# EAGLE design Si7020-BreakBoard (EAGLE 7.1.0)
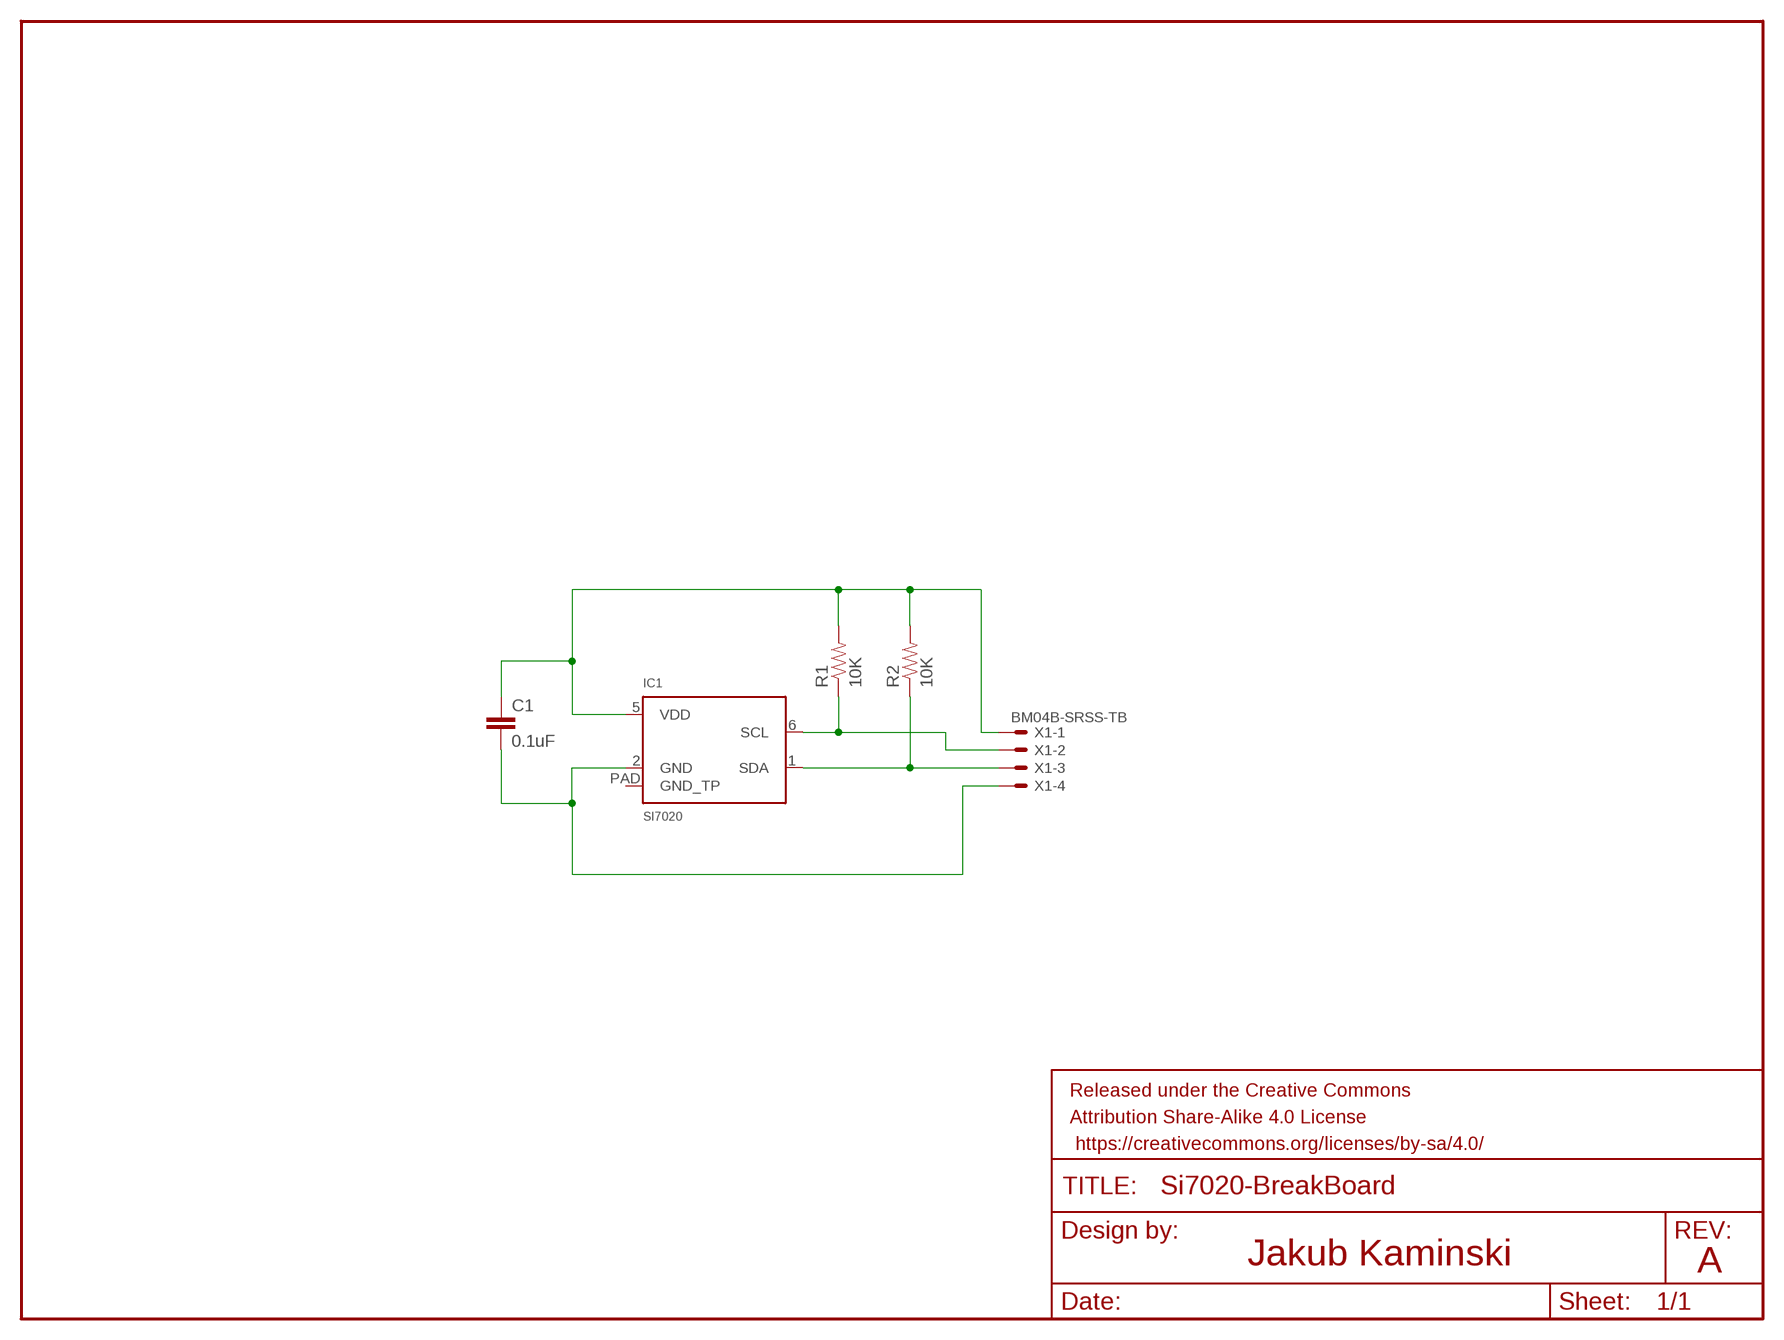
[diagram p0: schematic, sheet 1]

## Parts
C1  0.1uF  0.1UF-25V(+80/-20%)(0603)  [0603-CAP]
FRAME1  FRAME-LETTER  [CREATIVE_COMMONS]
IC1  SI7020  [DFN6-3X3]
R1  10K  10KOHM1/10W1%(0603)0603  [0603-RES]
R2  10K  10KOHM1/10W1%(0603)0603  [0603-RES]
X1  BM04B-SRSS-TB  [BM04B-SRSS-TB]

## Nets
N$1: C1.1 IC1.5(VDD) R1.2 R2.2 X1.1
N$2: IC1.6(SCL) R1.1 X1.2
N$3: C1.2 IC1.2(GND) X1.4
N$4: IC1.1(SDA) R2.1 X1.3
Unconnected: IC1.PAD(GND_TP)

## Notes on the sheet
- Jakub Kaminski | A

## Library data of the parts
C1 = SparkFun-Capacitors:0.1UF-25V(+80/-20%)(0603): CAP-00810 Ceramic Standard decoupling cap; PROD_ID: CAP-00810
FRAME1 = SparkFun-Aesthetics:FRAME-LETTER: Schematic Frame Standard 8.5x11 US Letter frame
IC1 = logic-supply:SI7020: Silicon Labs Si7020 I2C RH sensor
R1 R2 = SparkFun-Resistors:10KOHM1/10W1%(0603): RES-00824; PROD_ID: RES-00824
X1 = con-jst2:?M04B-SRSS-TB: Disconnectable Crimp style connector, 1.0mm pitch 4 contacts

## Board
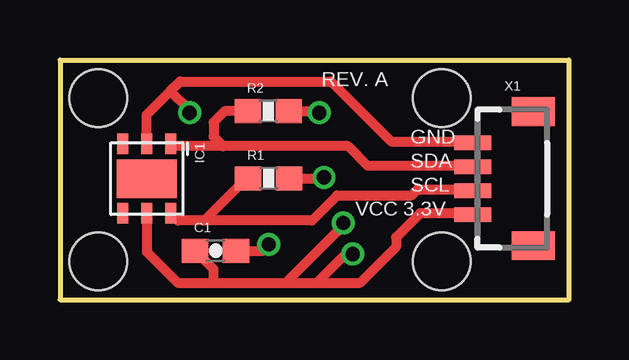
[diagram p1: board, top side]
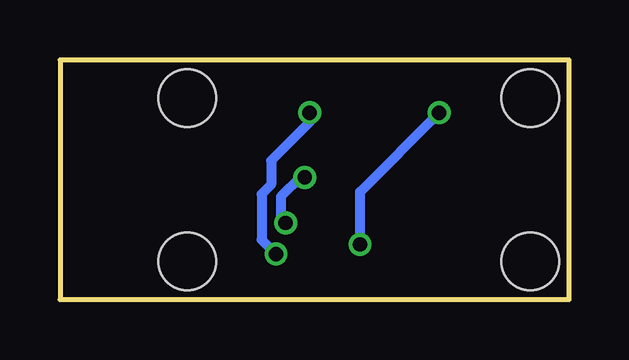
[diagram p2: board, bottom side, seen from below]

Size 21.2 x 10 mm. Coordinates in mm from the lower left corner, seen from the top.
Outline: 0,10 0,0 21.2,0 21.2,10 0,10
Copper layers (1*16): Top 0.0356mm / dielectric 1.5011mm / Bottom 0.0356mm
Design rules "OSHPARK-LaenPCBOrder": minimum track width 6mil, minimum drill 13mil, track to track 6mil, track to pad 6mil, pad to pad 6mil, via to via 6mil, smd to smd 6mil, copper to edge 15mil, drill to drill 6mil, minimum pad ring 7mil, minimum via ring 7mil, stop-mask expansion 3mil, vias tented up to drill 0mil, thermal gap 10mil
Holes 2.4 mm at 1.6,8.4 15.9,8.4 15.9,1.6 1.6,1.6

### Footprints (pad centres in the part's own frame; a part is rotated, then mirrored left to right if it is on the bottom)
0603-CAP = smd 1.1 x 1: 1 -0.85,0; 2 0.85,0
DFN6-3X3 = smd 0.85 x 0.45: 1 -1.45,1; 2 -1.45,0; 3 -1.45,-1; 4 1.45,-1; 5 1.45,0; 6 1.45,1 | smd 1.6 x 2.5: PAD 0,0
0603-RES = smd 1.1 x 1: 1 -0.85,0; 2 0.85,0
BM04B-SRSS-TB = smd 0.6 x 1.55: 1 1.5,-1.625; 2 0.5,-1.625; 3 -0.5,-1.625; 4 -1.5,-1.625 | smd 1.2 x 1.8: FIT@1 2.8,0.9; FIT@2 -2.8,0.9

### Placement (x,y rotation side)
C1  6.48,2.04 0 top
FRAME1  1.27,20.32 0 top  (outside the outline)
IC1  3.62,5.05 270 top
R1  8.69,5.06 0 top
R2  8.68,7.86 0 top
X1  18.82,5.05 270 top

### Tracks (layer width: path | path; a pad name or v marks a point on that pad's centre or on a via)
N$1  (via drill 0.6)
  Top 0.406: IC1.5 3.62,1.98 4.9,0.7 6.4,0.7 | 6.4,0.7 9.4,0.7 | R1.2 10.96,5.06 v11,5.1 | R2.2 10.74,7.86 v10.8,7.8 | v11.8,3.2 11.8,3.1 9.4,0.7 | X1.1 17.14,3.6 15,3.6 14,2.6 14,2.2 12.5,0.7 10.7,0.7 | 9.4,0.7 10.7,0.7 | v12.2,1.9 11.9,1.9 10.7,0.7 | 6.4,0.7 6.4,1.27 C1.1
  Bottom 0.406: v11,5.1 11.2,5.1 12,4.3 12,3.4 v11.8,3.2 | v10.8,7.8 10.8,7.4 12.4,5.8 12.4,4.8 12.8,4.4 12.8,2.5 v12.2,1.9
N$2
  Top 0.406: 6,3.3 10.5,3.3 11.55,4.35 14.65,4.35 14.9,4.6 17.14,4.6 X1.2 | 6,3.3 4.92,3.3 IC1.6 | R1.1 7.76,5.06 6,3.3
N$3  (via drill 0.6)
  Top 0.406: IC1.2 3.62,7.72 4.6,8.7 | 4.6,8.7 5,9.1 11.3,9.1 13.8,6.6 17.14,6.6 X1.4 | C1.2 8.44,2.04 v8.7,2.3 | v5.4,7.8 5.4,7.9 4.6,8.7
  Bottom 0.406: v8.7,2.3 8.7,4.5 v5.4,7.8
N$4
  Top 0.406: 6.8,6.4 12,6.4 12.8,5.6 17.14,5.6 X1.3 | 6.8,6.4 4.72,6.4 IC1.1 | R2.1 6.86,7.86 6.4,7.4 6.4,6.8 6.8,6.4

### Text on the board
tPlace: REV. A | GND | SDA | VCC 3.3V | SCL
Reference: Jakub Kaminski